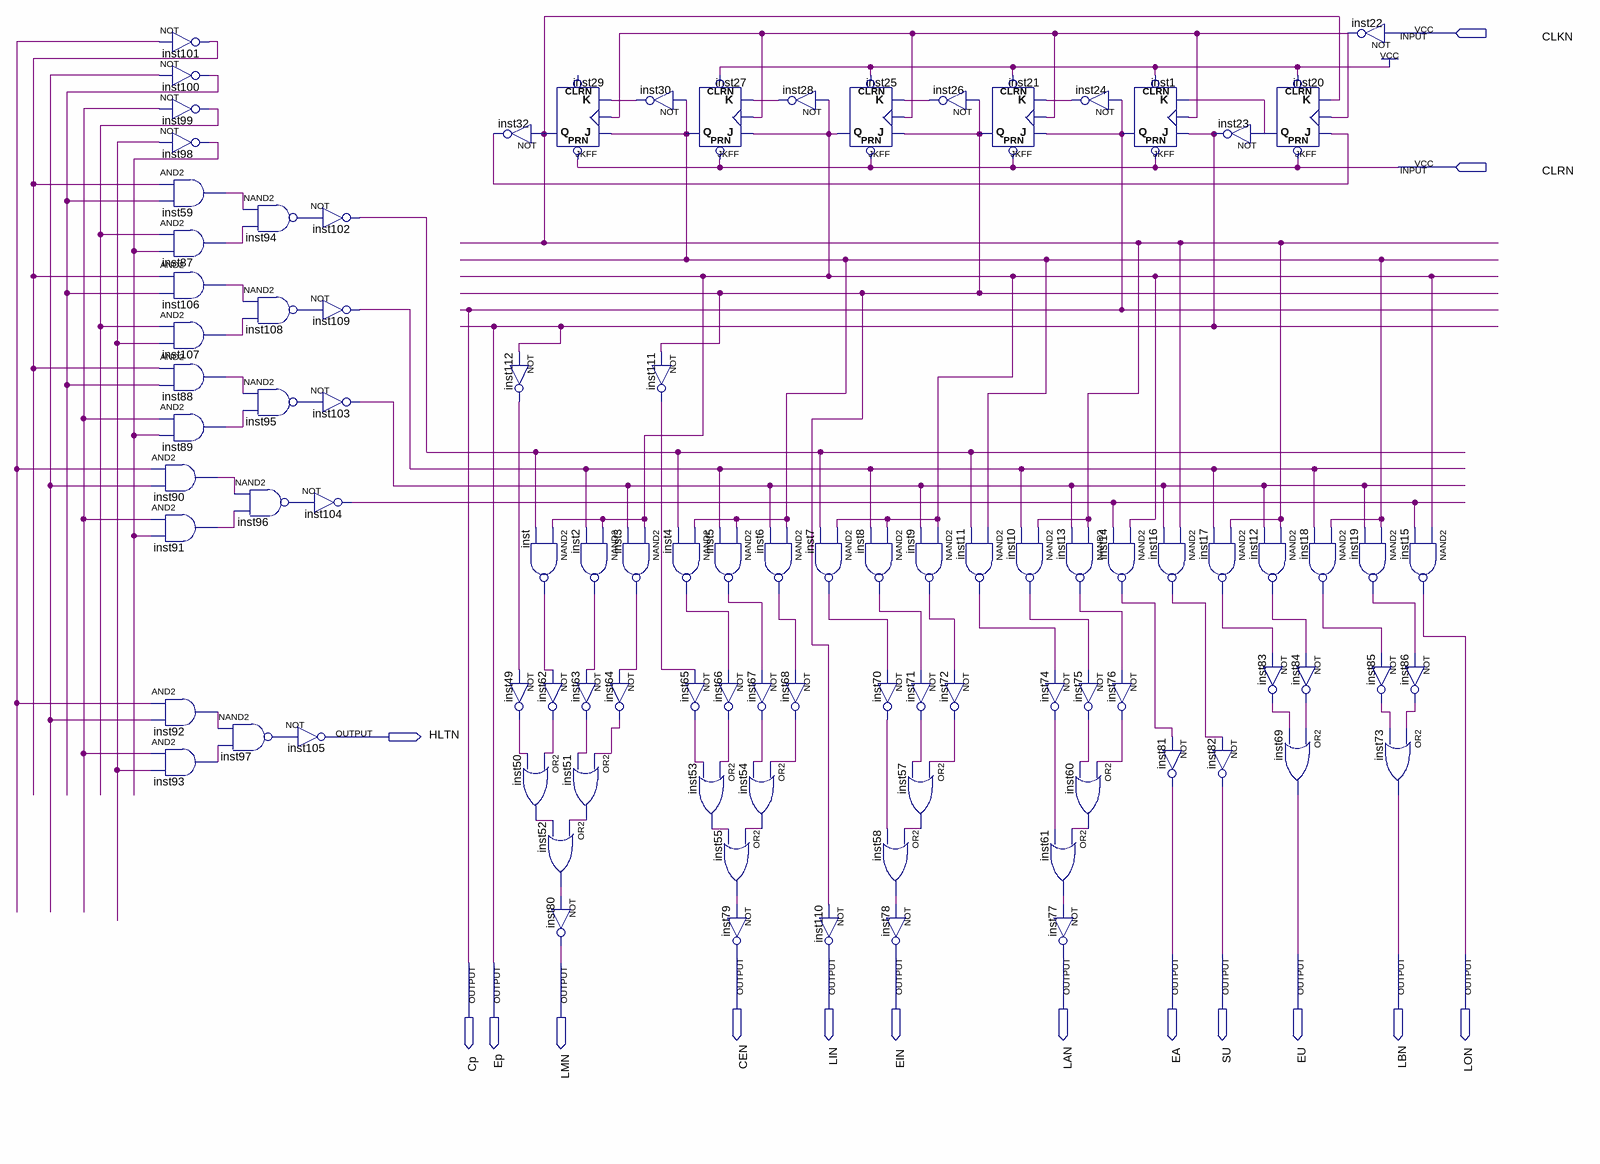
[diagram p0: schematic sheet]
// Quartus schematic DecisionMatrix.bdf as structural Verilog: 95 symbols, 15 pins
module DecisionMatrix (
  input  CLKN,
  input  CLRN,
  output HLTN,
  output CEN,
  output LIN,
  output EIN,
  output LAN,
  output EA,
  output SU,
  output EU,
  output LBN,
  output LON,
  output Cp,
  output Ep,
  output LMN
);

  wire inst2_out, inst3_out, inst4_out, inst5_out, inst6_out, inst7_out, inst8_out, inst9_out, inst10_out,
       inst11_out, inst12_out, inst13_out, inst14_out, inst16_out, inst17_out, inst18_out, inst19_out,
       inst20_q, inst21_q, inst22_out, inst24_out, inst25_q, inst26_out, inst27_q, inst28_out, inst29_q,
       inst30_out, inst32_out, inst49_out, inst50_out, inst51_out, inst52_out, inst53_out, inst54_out,
       inst55_out, inst57_out, inst58_out, inst59_out, inst60_out, inst61_out, inst62_out, inst63_out,
       inst64_out, inst65_out, inst66_out, inst67_out, inst68_out, inst70_out, inst71_out, inst72_out,
       inst74_out, inst75_out, inst76_out, inst83_out, inst84_out, inst85_out, inst86_out, inst87_out,
       inst88_out, inst89_out, inst90_out, inst91_out, inst92_out, inst93_out, inst94_out, inst95_out,
       inst96_out, inst97_out, inst98_out, inst99_out, inst100_out, inst101_out, inst102_out, inst103_out,
       inst104_out, inst106_out, inst107_out, inst108_out, inst109_out, inst111_out, inst112_out, inst_out,
       undriven, undriven_2, undriven_3, undriven_4;

  not inst101 (inst101_out, undriven);
  not inst100 (inst100_out, undriven_2);
  not inst99 (inst99_out, undriven_3);
  not inst98 (inst98_out, undriven_4);
  and inst59 (inst59_out, inst101_out, inst100_out);
  and inst87 (inst87_out, inst99_out, inst98_out);
  and inst106 (inst106_out, inst101_out, inst100_out);
  and inst107 (inst107_out, inst99_out, undriven_4);
  and inst88 (inst88_out, inst101_out, inst100_out);
  and inst89 (inst89_out, undriven_3, inst98_out);
  and inst90 (inst90_out, undriven, undriven_2);
  and inst91 (inst91_out, undriven_3, inst98_out);
  and inst92 (inst92_out, undriven, undriven_2);
  and inst93 (inst93_out, undriven_3, undriven_4);
  nand inst94 (inst94_out, inst59_out, inst87_out);
  nand inst108 (inst108_out, inst106_out, inst107_out);
  nand inst95 (inst95_out, inst88_out, inst89_out);
  nand inst96 (inst96_out, inst90_out, inst91_out);
  nand inst97 (inst97_out, inst92_out, inst93_out);
  not inst102 (inst102_out, inst94_out);
  not inst109 (inst109_out, inst108_out);
  not inst103 (inst103_out, inst95_out);
  not inst104 (inst104_out, inst96_out);
  not inst105 (HLTN, inst97_out);
  not inst32 (inst32_out, inst29_q);
  not inst112 (inst112_out, Ep);
  nand inst (inst_out, inst25_q, inst102_out);
  not inst49 (inst49_out, inst112_out);
  or inst50 (inst50_out, inst62_out, inst49_out);
  JKFF inst29 (.PRN(CLRN), .K(inst30_out), .J(inst27_q), .CLK(inst22_out), .Q(inst29_q));  // open: CLRN
  nand inst2 (inst2_out, inst25_q, inst109_out);
  not inst62 (inst62_out, inst_out);
  not inst63 (inst63_out, inst2_out);
  or inst51 (inst51_out, inst64_out, inst63_out);
  or inst52 (inst52_out, inst51_out, inst50_out);
  not inst80 (LMN, inst52_out);
  not inst30 (inst30_out, inst27_q);
  not inst111 (inst111_out, inst21_q);
  nand inst3 (inst3_out, inst25_q, inst103_out);
  nand inst4 (inst4_out, inst27_q, inst102_out);
  not inst64 (inst64_out, inst3_out);
  JKFF inst27 (.PRN(CLRN), .CLRN(1'b1), .K(inst28_out), .J(inst25_q), .CLK(inst22_out), .Q(inst27_q));
  nand inst5 (inst5_out, inst27_q, inst109_out);
  not inst65 (inst65_out, inst111_out);
  not inst66 (inst66_out, inst4_out);
  or inst53 (inst53_out, inst66_out, inst65_out);
  or inst55 (inst55_out, inst54_out, inst53_out);
  not inst79 (CEN, inst55_out);
  not inst28 (inst28_out, inst25_q);
  nand inst6 (inst6_out, inst27_q, inst103_out);
  not inst67 (inst67_out, inst5_out);
  not inst68 (inst68_out, inst6_out);
  or inst54 (inst54_out, inst68_out, inst67_out);
  JKFF inst25 (.PRN(CLRN), .CLRN(1'b1), .K(inst26_out), .J(inst21_q), .CLK(inst22_out), .Q(inst25_q));
  nand inst7 (inst7_out, inst25_q, inst102_out);
  nand inst8 (inst8_out, inst25_q, inst109_out);
  not inst110 (LIN, inst21_q);
  not inst26 (inst26_out, inst21_q);
  nand inst9 (inst9_out, inst25_q, inst103_out);
  not inst70 (inst70_out, inst7_out);
  not inst71 (inst71_out, inst8_out);
  or inst57 (inst57_out, inst72_out, inst71_out);
  or inst58 (inst58_out, inst57_out, inst70_out);
  not inst78 (EIN, inst58_out);
  JKFF inst21 (.PRN(CLRN), .CLRN(1'b1), .K(inst24_out), .J(Cp), .CLK(inst22_out), .Q(inst21_q));
  nand inst11 (inst11_out, inst27_q, inst102_out);
  not inst72 (inst72_out, inst9_out);
  nand inst10 (inst10_out, inst29_q, inst109_out);
  nand inst13 (inst13_out, inst29_q, inst103_out);
  not inst74 (inst74_out, inst11_out);
  or inst60 (inst60_out, inst76_out, inst75_out);
  or inst61 (inst61_out, inst60_out, inst74_out);
  not inst77 (LAN, inst61_out);
  JKFF inst1 (.PRN(CLRN), .CLRN(1'b1), .K(inst20_q), .J(Ep), .CLK(inst22_out), .Q(Cp));
  not inst24 (inst24_out, Cp);
  nand inst14 (inst14_out, inst25_q, inst104_out);
  not inst75 (inst75_out, inst10_out);
  not inst76 (inst76_out, inst13_out);
  nand inst16 (inst16_out, inst29_q, inst103_out);
  nand inst17 (inst17_out, inst29_q, inst109_out);
  not inst81 (EA, inst14_out);
  JKFF inst20 (.PRN(CLRN), .CLRN(1'b1), .K(inst29_q), .J(inst32_out), .CLK(inst22_out), .Q(inst20_q));
  not inst23 (Ep, inst20_q);
  nand inst12 (inst12_out, inst29_q, inst103_out);
  not inst83 (inst83_out, inst17_out);
  not inst82 (SU, inst16_out);
  nand inst18 (inst18_out, inst27_q, inst109_out);
  not inst84 (inst84_out, inst12_out);
  or inst69 (EU, inst84_out, inst83_out);
  not inst22 (inst22_out, CLKN);
  nand inst15 (LON, inst25_q, inst104_out);
  nand inst19 (inst19_out, inst27_q, inst103_out);
  not inst85 (inst85_out, inst18_out);
  not inst86 (inst86_out, inst19_out);
  or inst73 (LBN, inst86_out, inst85_out);
endmodule
